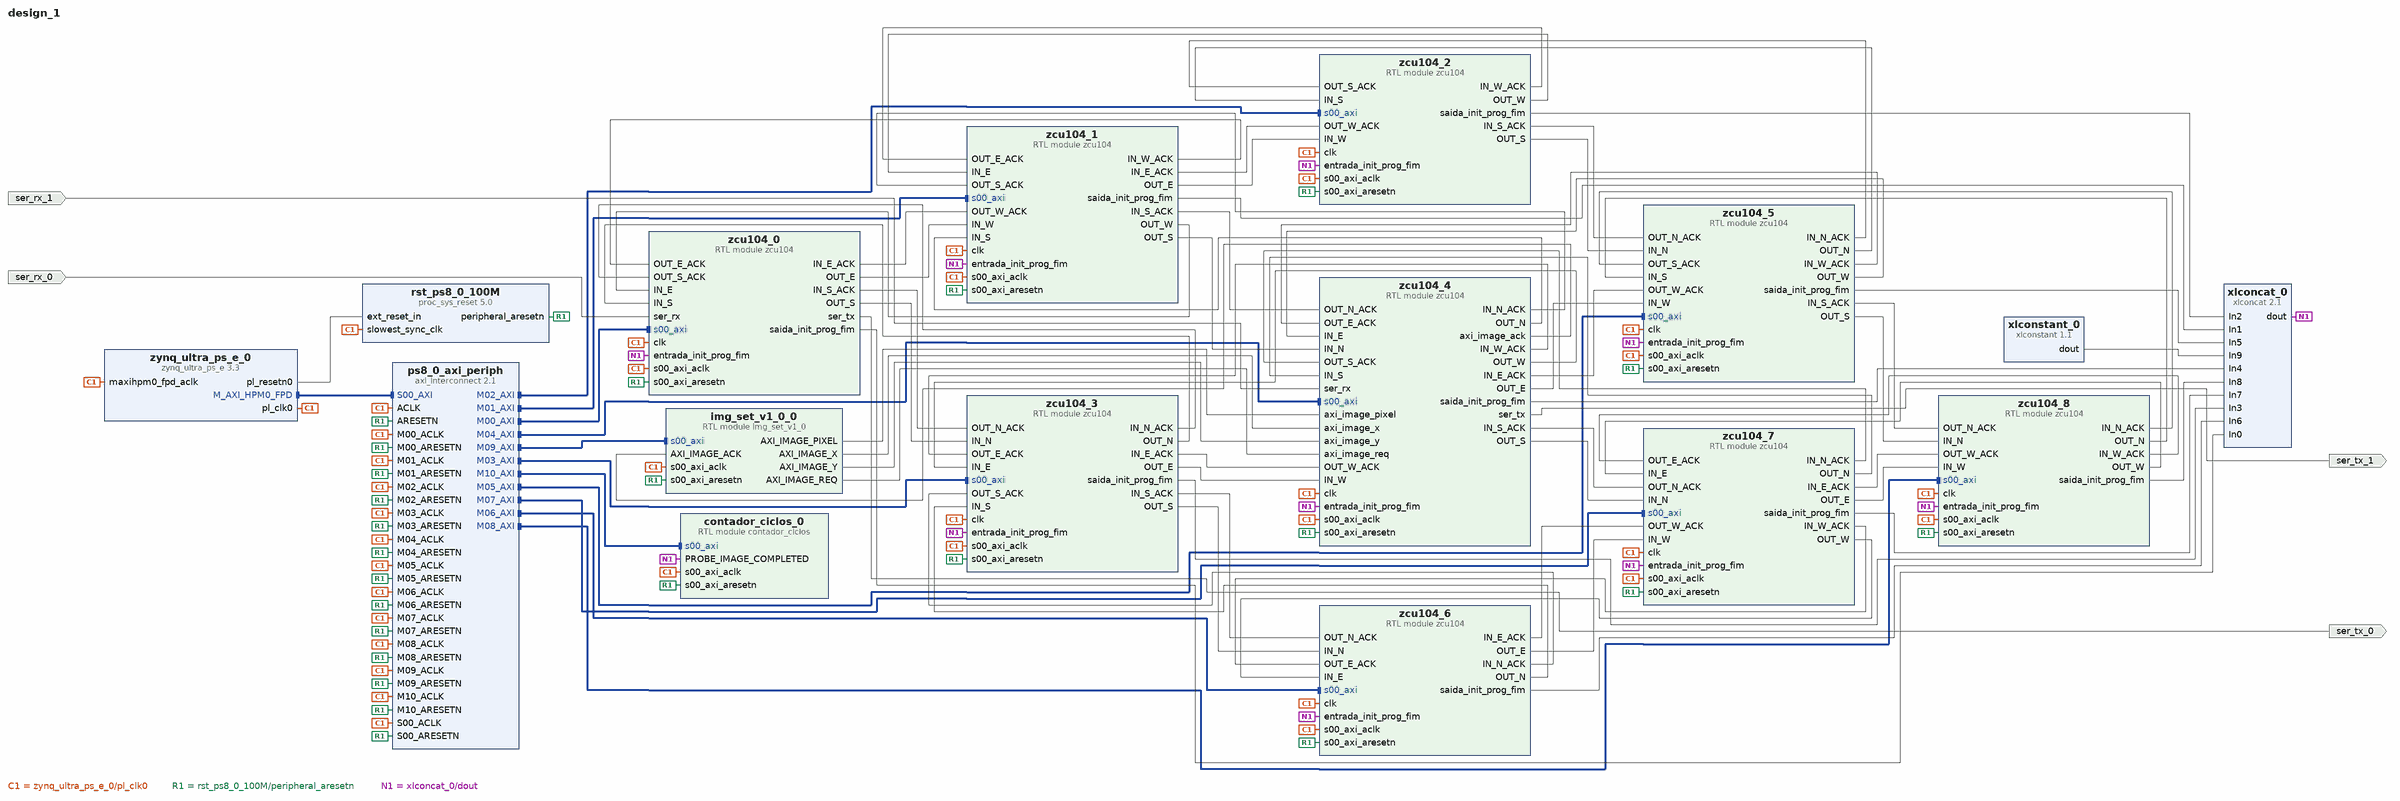
[diagram p0: block diagram of the top level]
# Vivado block design design_1, xczu7ev-ffvc1156-2-e, Vivado 2019.1
create_bd_design design_1

create_bd_port -dir I ser_rx_0
create_bd_port -dir O ser_tx_0
create_bd_port -dir I ser_rx_1
create_bd_port -dir O ser_tx_1

create_bd_cell -type ip -vlnv xilinx.com:ip:zynq_ultra_ps_e:3.3 zynq_ultra_ps_e_0
set_property -dict [list \
  CONFIG.PSU_BANK_0_IO_STANDARD LVCMOS18 \
  CONFIG.PSU_BANK_1_IO_STANDARD LVCMOS18 \
  CONFIG.PSU_BANK_2_IO_STANDARD LVCMOS18 \
  CONFIG.PSU_USB3__DUAL_CLOCK_ENABLE 1 \
  CONFIG.PSU__CAN1__PERIPHERAL__ENABLE 1 \
  CONFIG.PSU__CAN1__PERIPHERAL__IO {MIO 24 .. 25} \
  CONFIG.PSU__CRF_APB__ACPU_CTRL__FREQMHZ 1200 \
  CONFIG.PSU__CRF_APB__ACPU_CTRL__SRCSEL APLL \
  CONFIG.PSU__CRF_APB__APLL_CTRL__SRCSEL PSS_REF_CLK \
  CONFIG.PSU__CRF_APB__DBG_FPD_CTRL__FREQMHZ 250 \
  CONFIG.PSU__CRF_APB__DBG_FPD_CTRL__SRCSEL IOPLL \
  CONFIG.PSU__CRF_APB__DBG_TRACE_CTRL__FREQMHZ 250 \
  CONFIG.PSU__CRF_APB__DBG_TRACE_CTRL__SRCSEL IOPLL \
  CONFIG.PSU__CRF_APB__DBG_TSTMP_CTRL__FREQMHZ 250 \
  CONFIG.PSU__CRF_APB__DBG_TSTMP_CTRL__SRCSEL IOPLL \
  CONFIG.PSU__CRF_APB__DDR_CTRL__FREQMHZ 1067 \
  CONFIG.PSU__CRF_APB__DDR_CTRL__SRCSEL DPLL \
  CONFIG.PSU__CRF_APB__DPDMA_REF_CTRL__FREQMHZ 600 \
  CONFIG.PSU__CRF_APB__DPDMA_REF_CTRL__SRCSEL APLL \
  CONFIG.PSU__CRF_APB__DPLL_CTRL__SRCSEL PSS_REF_CLK \
  CONFIG.PSU__CRF_APB__DP_AUDIO_REF_CTRL__SRCSEL RPLL \
  CONFIG.PSU__CRF_APB__DP_STC_REF_CTRL__SRCSEL RPLL \
  CONFIG.PSU__CRF_APB__DP_VIDEO_REF_CTRL__SRCSEL VPLL \
  CONFIG.PSU__CRF_APB__GDMA_REF_CTRL__FREQMHZ 600 \
  CONFIG.PSU__CRF_APB__GDMA_REF_CTRL__SRCSEL APLL \
  CONFIG.PSU__CRF_APB__GPU_REF_CTRL__FREQMHZ 500 \
  CONFIG.PSU__CRF_APB__GPU_REF_CTRL__SRCSEL IOPLL \
  CONFIG.PSU__CRF_APB__TOPSW_LSBUS_CTRL__FREQMHZ 100 \
  CONFIG.PSU__CRF_APB__TOPSW_LSBUS_CTRL__SRCSEL IOPLL \
  CONFIG.PSU__CRF_APB__TOPSW_MAIN_CTRL__FREQMHZ 533.33 \
  CONFIG.PSU__CRF_APB__TOPSW_MAIN_CTRL__SRCSEL DPLL \
  CONFIG.PSU__CRF_APB__VPLL_CTRL__SRCSEL PSS_REF_CLK \
  CONFIG.PSU__CRL_APB__ADMA_REF_CTRL__FREQMHZ 500 \
  CONFIG.PSU__CRL_APB__ADMA_REF_CTRL__SRCSEL IOPLL \
  CONFIG.PSU__CRL_APB__CAN1_REF_CTRL__FREQMHZ 100 \
  CONFIG.PSU__CRL_APB__CAN1_REF_CTRL__SRCSEL IOPLL \
  CONFIG.PSU__CRL_APB__CPU_R5_CTRL__FREQMHZ 500 \
  CONFIG.PSU__CRL_APB__CPU_R5_CTRL__SRCSEL IOPLL \
  CONFIG.PSU__CRL_APB__DBG_LPD_CTRL__FREQMHZ 250 \
  CONFIG.PSU__CRL_APB__DBG_LPD_CTRL__SRCSEL IOPLL \
  CONFIG.PSU__CRL_APB__GEM3_REF_CTRL__FREQMHZ 125 \
  CONFIG.PSU__CRL_APB__GEM3_REF_CTRL__SRCSEL IOPLL \
  CONFIG.PSU__CRL_APB__I2C0_REF_CTRL__FREQMHZ 100 \
  CONFIG.PSU__CRL_APB__I2C0_REF_CTRL__SRCSEL IOPLL \
  CONFIG.PSU__CRL_APB__I2C1_REF_CTRL__FREQMHZ 100 \
  CONFIG.PSU__CRL_APB__I2C1_REF_CTRL__SRCSEL IOPLL \
  CONFIG.PSU__CRL_APB__IOPLL_CTRL__SRCSEL PSS_REF_CLK \
  CONFIG.PSU__CRL_APB__IOU_SWITCH_CTRL__FREQMHZ 250 \
  CONFIG.PSU__CRL_APB__IOU_SWITCH_CTRL__SRCSEL IOPLL \
  CONFIG.PSU__CRL_APB__LPD_LSBUS_CTRL__FREQMHZ 100 \
  CONFIG.PSU__CRL_APB__LPD_LSBUS_CTRL__SRCSEL IOPLL \
  CONFIG.PSU__CRL_APB__LPD_SWITCH_CTRL__FREQMHZ 500 \
  CONFIG.PSU__CRL_APB__LPD_SWITCH_CTRL__SRCSEL IOPLL \
  CONFIG.PSU__CRL_APB__PCAP_CTRL__FREQMHZ 200 \
  CONFIG.PSU__CRL_APB__PCAP_CTRL__SRCSEL IOPLL \
  CONFIG.PSU__CRL_APB__PL0_REF_CTRL__FREQMHZ 100 \
  CONFIG.PSU__CRL_APB__PL0_REF_CTRL__SRCSEL IOPLL \
  CONFIG.PSU__CRL_APB__QSPI_REF_CTRL__FREQMHZ 125 \
  CONFIG.PSU__CRL_APB__QSPI_REF_CTRL__SRCSEL IOPLL \
  CONFIG.PSU__CRL_APB__RPLL_CTRL__SRCSEL PSS_REF_CLK \
  CONFIG.PSU__CRL_APB__SDIO1_REF_CTRL__FREQMHZ 200 \
  CONFIG.PSU__CRL_APB__SDIO1_REF_CTRL__SRCSEL IOPLL \
  CONFIG.PSU__CRL_APB__TIMESTAMP_REF_CTRL__FREQMHZ 100 \
  CONFIG.PSU__CRL_APB__TIMESTAMP_REF_CTRL__SRCSEL IOPLL \
  CONFIG.PSU__CRL_APB__UART0_REF_CTRL__FREQMHZ 100 \
  CONFIG.PSU__CRL_APB__UART0_REF_CTRL__SRCSEL IOPLL \
  CONFIG.PSU__CRL_APB__UART1_REF_CTRL__FREQMHZ 100 \
  CONFIG.PSU__CRL_APB__UART1_REF_CTRL__SRCSEL IOPLL \
  CONFIG.PSU__CRL_APB__USB0_BUS_REF_CTRL__FREQMHZ 250 \
  CONFIG.PSU__CRL_APB__USB0_BUS_REF_CTRL__SRCSEL IOPLL \
  CONFIG.PSU__CRL_APB__USB3_DUAL_REF_CTRL__FREQMHZ 20 \
  CONFIG.PSU__CRL_APB__USB3_DUAL_REF_CTRL__SRCSEL IOPLL \
  CONFIG.PSU__CRL_APB__USB3__ENABLE 1 \
  CONFIG.PSU__DDRC__BUS_WIDTH {64 Bit} \
  CONFIG.PSU__DDRC__COMPONENTS Components \
  CONFIG.PSU__DDRC__DEVICE_CAPACITY {4096 MBits} \
  CONFIG.PSU__DDRC__DRAM_WIDTH {16 Bits} \
  CONFIG.PSU__DDRC__ECC Disabled \
  CONFIG.PSU__DDRC__MEMORY_TYPE {DDR 4} \
  CONFIG.PSU__DDRC__SPEED_BIN DDR4_2133P \
  CONFIG.PSU__DDR_HIGH_ADDRESS_GUI_ENABLE 0 \
  CONFIG.PSU__DDR__INTERFACE__FREQMHZ 533.500 \
  CONFIG.PSU__DISPLAYPORT__LANE0__ENABLE 1 \
  CONFIG.PSU__DISPLAYPORT__LANE0__IO {GT Lane1} \
  CONFIG.PSU__DISPLAYPORT__LANE1__ENABLE 1 \
  CONFIG.PSU__DISPLAYPORT__LANE1__IO {GT Lane0} \
  CONFIG.PSU__DISPLAYPORT__PERIPHERAL__ENABLE 1 \
  CONFIG.PSU__DLL__ISUSED 1 \
  CONFIG.PSU__DPAUX__PERIPHERAL__ENABLE 1 \
  CONFIG.PSU__DPAUX__PERIPHERAL__IO {MIO 27 .. 30} \
  CONFIG.PSU__DP__LANE_SEL {Dual Lower} \
  CONFIG.PSU__DP__REF_CLK_FREQ 27 \
  CONFIG.PSU__DP__REF_CLK_SEL {Ref Clk3} \
  CONFIG.PSU__ENET3__FIFO__ENABLE 0 \
  CONFIG.PSU__ENET3__GRP_MDIO__ENABLE 1 \
  CONFIG.PSU__ENET3__GRP_MDIO__IO {MIO 76 .. 77} \
  CONFIG.PSU__ENET3__PERIPHERAL__ENABLE 1 \
  CONFIG.PSU__ENET3__PERIPHERAL__IO {MIO 64 .. 75} \
  CONFIG.PSU__ENET3__PTP__ENABLE 0 \
  CONFIG.PSU__ENET3__TSU__ENABLE 0 \
  CONFIG.PSU__FPGA_PL0_ENABLE 1 \
  CONFIG.PSU__GEM3_COHERENCY 0 \
  CONFIG.PSU__GEM3_ROUTE_THROUGH_FPD 0 \
  CONFIG.PSU__GEM__TSU__ENABLE 0 \
  CONFIG.PSU__GPIO0_MIO__PERIPHERAL__ENABLE 0 \
  CONFIG.PSU__GPIO1_MIO__PERIPHERAL__ENABLE 0 \
  CONFIG.PSU__GT__LINK_SPEED HBR \
  CONFIG.PSU__GT__PRE_EMPH_LVL_4 0 \
  CONFIG.PSU__GT__VLT_SWNG_LVL_4 0 \
  CONFIG.PSU__I2C0__PERIPHERAL__ENABLE 0 \
  CONFIG.PSU__I2C1__PERIPHERAL__ENABLE 1 \
  CONFIG.PSU__I2C1__PERIPHERAL__IO {MIO 16 .. 17} \
  CONFIG.PSU__IOU_SLCR__IOU_TTC_APB_CLK__TTC0_SEL APB \
  CONFIG.PSU__IOU_SLCR__IOU_TTC_APB_CLK__TTC1_SEL APB \
  CONFIG.PSU__IOU_SLCR__IOU_TTC_APB_CLK__TTC2_SEL APB \
  CONFIG.PSU__IOU_SLCR__IOU_TTC_APB_CLK__TTC3_SEL APB \
  CONFIG.PSU__MAXIGP0__DATA_WIDTH 32 \
  CONFIG.PSU__OVERRIDE__BASIC_CLOCK 0 \
  CONFIG.PSU__PRESET_APPLIED 1 \
  CONFIG.PSU__PSS_REF_CLK__FREQMHZ 33.333333 \
  CONFIG.PSU__QSPI_COHERENCY 0 \
  CONFIG.PSU__QSPI_ROUTE_THROUGH_FPD 0 \
  CONFIG.PSU__QSPI__GRP_FBCLK__ENABLE 1 \
  CONFIG.PSU__QSPI__GRP_FBCLK__IO {MIO 6} \
  CONFIG.PSU__QSPI__PERIPHERAL__DATA_MODE x4 \
  CONFIG.PSU__QSPI__PERIPHERAL__ENABLE 1 \
  CONFIG.PSU__QSPI__PERIPHERAL__IO {MIO 0 .. 5} \
  CONFIG.PSU__QSPI__PERIPHERAL__MODE Single \
  CONFIG.PSU__SATA__LANE1__IO {GT Lane3} \
  CONFIG.PSU__SATA__PERIPHERAL__ENABLE 1 \
  CONFIG.PSU__SATA__REF_CLK_FREQ 125 \
  CONFIG.PSU__SATA__REF_CLK_SEL {Ref Clk1} \
  CONFIG.PSU__SD1_COHERENCY 0 \
  CONFIG.PSU__SD1_ROUTE_THROUGH_FPD 0 \
  CONFIG.PSU__SD1__DATA_TRANSFER_MODE 4Bit \
  CONFIG.PSU__SD1__GRP_CD__ENABLE 1 \
  CONFIG.PSU__SD1__GRP_CD__IO {MIO 45} \
  CONFIG.PSU__SD1__GRP_POW__ENABLE 0 \
  CONFIG.PSU__SD1__GRP_WP__ENABLE 0 \
  CONFIG.PSU__SD1__PERIPHERAL__ENABLE 1 \
  CONFIG.PSU__SD1__PERIPHERAL__IO {MIO 46 .. 51} \
  CONFIG.PSU__SD1__SLOT_TYPE {SD 2.0} \
  CONFIG.PSU__SWDT0__CLOCK__ENABLE 0 \
  CONFIG.PSU__SWDT0__PERIPHERAL__ENABLE 1 \
  CONFIG.PSU__SWDT0__RESET__ENABLE 0 \
  CONFIG.PSU__SWDT1__CLOCK__ENABLE 0 \
  CONFIG.PSU__SWDT1__PERIPHERAL__ENABLE 1 \
  CONFIG.PSU__SWDT1__RESET__ENABLE 0 \
  CONFIG.PSU__TSU__BUFG_PORT_PAIR 0 \
  CONFIG.PSU__TTC0__CLOCK__ENABLE 0 \
  CONFIG.PSU__TTC0__PERIPHERAL__ENABLE 1 \
  CONFIG.PSU__TTC0__WAVEOUT__ENABLE 0 \
  CONFIG.PSU__TTC1__CLOCK__ENABLE 0 \
  CONFIG.PSU__TTC1__PERIPHERAL__ENABLE 1 \
  CONFIG.PSU__TTC1__WAVEOUT__ENABLE 0 \
  CONFIG.PSU__TTC2__CLOCK__ENABLE 0 \
  CONFIG.PSU__TTC2__PERIPHERAL__ENABLE 1 \
  CONFIG.PSU__TTC2__WAVEOUT__ENABLE 0 \
  CONFIG.PSU__TTC3__CLOCK__ENABLE 0 \
  CONFIG.PSU__TTC3__PERIPHERAL__ENABLE 1 \
  CONFIG.PSU__TTC3__WAVEOUT__ENABLE 0 \
  CONFIG.PSU__UART0__BAUD_RATE 115200 \
  CONFIG.PSU__UART0__MODEM__ENABLE 0 \
  CONFIG.PSU__UART0__PERIPHERAL__ENABLE 1 \
  CONFIG.PSU__UART0__PERIPHERAL__IO {MIO 18 .. 19} \
  CONFIG.PSU__UART1__BAUD_RATE 115200 \
  CONFIG.PSU__UART1__MODEM__ENABLE 0 \
  CONFIG.PSU__UART1__PERIPHERAL__ENABLE 1 \
  CONFIG.PSU__UART1__PERIPHERAL__IO {MIO 20 .. 21} \
  CONFIG.PSU__USB0_COHERENCY 0 \
  CONFIG.PSU__USB0__PERIPHERAL__ENABLE 1 \
  CONFIG.PSU__USB0__PERIPHERAL__IO {MIO 52 .. 63} \
  CONFIG.PSU__USB0__REF_CLK_FREQ 26 \
  CONFIG.PSU__USB0__REF_CLK_SEL {Ref Clk2} \
  CONFIG.PSU__USB2_0__EMIO__ENABLE 0 \
  CONFIG.PSU__USB3_0__EMIO__ENABLE 0 \
  CONFIG.PSU__USB3_0__PERIPHERAL__ENABLE 1 \
  CONFIG.PSU__USB3_0__PERIPHERAL__IO {GT Lane2} \
  CONFIG.PSU__USB__RESET__MODE {Boot Pin} \
  CONFIG.PSU__USB__RESET__POLARITY {Active Low} \
  CONFIG.PSU__USE__IRQ0 1 \
  CONFIG.PSU__USE__M_AXI_GP0 1 \
  CONFIG.PSU__USE__M_AXI_GP1 0 \
  CONFIG.PSU__USE__M_AXI_GP2 0 \
  CONFIG.SUBPRESET1 Custom \
] [get_bd_cells zynq_ultra_ps_e_0]
# 86 more settings of zynq_ultra_ps_e_0 are not shown: defaults, MIO pin electricals, DDR timing, and values the tool derives
create_bd_cell -type ip -vlnv xilinx.com:ip:axi_interconnect:2.1 ps8_0_axi_periph
set_property -dict {CONFIG.NUM_MI 11} [get_bd_cells ps8_0_axi_periph]
create_bd_cell -type ip -vlnv xilinx.com:ip:proc_sys_reset:5.0 rst_ps8_0_100M
create_bd_cell -type module -reference img_set_v1_0 img_set_v1_0_0
create_bd_cell -type ip -vlnv xilinx.com:ip:xlconcat:2.1 xlconcat_0
set_property -dict {CONFIG.IN9_WIDTH 23 CONFIG.NUM_PORTS 10} [get_bd_cells xlconcat_0]
create_bd_cell -type module -reference contador_ciclos contador_ciclos_0
create_bd_cell -type ip -vlnv xilinx.com:ip:xlconstant:1.1 xlconstant_0
set_property -dict {CONFIG.CONST_VAL 0 CONFIG.CONST_WIDTH 23} [get_bd_cells xlconstant_0]
create_bd_cell -type module -reference zcu104 zcu104_0
set_property -dict [list \
  CONFIG.a_steps 10 \
  CONFIG.buffer_length 20 \
  CONFIG.subimg_height 80 \
  CONFIG.subimg_width 80 \
  CONFIG.y_init 0 \
] [get_bd_cells zcu104_0]
create_bd_cell -type module -reference zcu104 zcu104_1
set_property -dict [list \
  CONFIG.a_steps 10 \
  CONFIG.buffer_length 20 \
  CONFIG.subimg_height 80 \
  CONFIG.subimg_width 80 \
  CONFIG.x_init 80 \
  CONFIG.x_local 1 \
  CONFIG.y_init 0 \
] [get_bd_cells zcu104_1]
create_bd_cell -type module -reference zcu104 zcu104_3
set_property -dict [list \
  CONFIG.a_steps 10 \
  CONFIG.buffer_length 20 \
  CONFIG.subimg_height 80 \
  CONFIG.subimg_width 80 \
  CONFIG.x_init 0 \
  CONFIG.y_init 80 \
  CONFIG.y_local 1 \
] [get_bd_cells zcu104_3]
create_bd_cell -type module -reference zcu104 zcu104_2
set_property -dict [list \
  CONFIG.a_steps 10 \
  CONFIG.buffer_length 20 \
  CONFIG.subimg_height 80 \
  CONFIG.subimg_width 80 \
  CONFIG.x_init 160 \
  CONFIG.x_local 2 \
  CONFIG.y_init 0 \
] [get_bd_cells zcu104_2]
create_bd_cell -type module -reference zcu104 zcu104_4
set_property -dict [list \
  CONFIG.a_steps 10 \
  CONFIG.buffer_length 20 \
  CONFIG.subimg_height 80 \
  CONFIG.subimg_width 80 \
  CONFIG.x_init 80 \
  CONFIG.x_local 1 \
  CONFIG.y_init 80 \
  CONFIG.y_local 1 \
] [get_bd_cells zcu104_4]
create_bd_cell -type module -reference zcu104 zcu104_5
set_property -dict [list \
  CONFIG.a_steps 10 \
  CONFIG.buffer_length 20 \
  CONFIG.subimg_height 80 \
  CONFIG.subimg_width 80 \
  CONFIG.x_init 160 \
  CONFIG.x_local 2 \
  CONFIG.y_init 80 \
  CONFIG.y_local 1 \
] [get_bd_cells zcu104_5]
create_bd_cell -type module -reference zcu104 zcu104_6
set_property -dict [list \
  CONFIG.a_steps 10 \
  CONFIG.buffer_length 20 \
  CONFIG.subimg_height 80 \
  CONFIG.subimg_width 80 \
  CONFIG.x_init 0 \
  CONFIG.x_local 0 \
  CONFIG.y_init 160 \
  CONFIG.y_local 2 \
] [get_bd_cells zcu104_6]
create_bd_cell -type module -reference zcu104 zcu104_7
set_property -dict [list \
  CONFIG.a_steps 10 \
  CONFIG.buffer_length 20 \
  CONFIG.subimg_height 80 \
  CONFIG.subimg_width 80 \
  CONFIG.x_init 80 \
  CONFIG.x_local 1 \
  CONFIG.y_init 160 \
  CONFIG.y_local 2 \
] [get_bd_cells zcu104_7]
create_bd_cell -type module -reference zcu104 zcu104_8
set_property -dict [list \
  CONFIG.a_steps 10 \
  CONFIG.buffer_length 20 \
  CONFIG.subimg_height 80 \
  CONFIG.subimg_width 80 \
  CONFIG.x_init 160 \
  CONFIG.x_local 2 \
  CONFIG.y_init 160 \
  CONFIG.y_local 2 \
] [get_bd_cells zcu104_8]

# ---- connections ----

connect_bd_intf_net [get_bd_intf_pins ps8_0_axi_periph/M02_AXI] [get_bd_intf_pins zcu104_2/s00_axi]
connect_bd_intf_net [get_bd_intf_pins zynq_ultra_ps_e_0/M_AXI_HPM0_FPD] [get_bd_intf_pins ps8_0_axi_periph/S00_AXI]
connect_bd_intf_net [get_bd_intf_pins ps8_0_axi_periph/M06_AXI] [get_bd_intf_pins zcu104_6/s00_axi]
connect_bd_intf_net [get_bd_intf_pins ps8_0_axi_periph/M05_AXI] [get_bd_intf_pins zcu104_5/s00_axi]
connect_bd_intf_net [get_bd_intf_pins ps8_0_axi_periph/M03_AXI] [get_bd_intf_pins zcu104_3/s00_axi]
connect_bd_intf_net [get_bd_intf_pins ps8_0_axi_periph/M08_AXI] [get_bd_intf_pins zcu104_8/s00_axi]
connect_bd_intf_net [get_bd_intf_pins ps8_0_axi_periph/M09_AXI] [get_bd_intf_pins img_set_v1_0_0/s00_axi]
connect_bd_intf_net [get_bd_intf_pins ps8_0_axi_periph/M00_AXI] [get_bd_intf_pins zcu104_0/s00_axi]
connect_bd_intf_net [get_bd_intf_pins ps8_0_axi_periph/M04_AXI] [get_bd_intf_pins zcu104_4/s00_axi]
connect_bd_intf_net [get_bd_intf_pins ps8_0_axi_periph/M01_AXI] [get_bd_intf_pins zcu104_1/s00_axi]
connect_bd_intf_net [get_bd_intf_pins ps8_0_axi_periph/M10_AXI] [get_bd_intf_pins contador_ciclos_0/s00_axi]
connect_bd_intf_net [get_bd_intf_pins ps8_0_axi_periph/M07_AXI] [get_bd_intf_pins zcu104_7/s00_axi]
connect_bd_net [get_bd_pins zynq_ultra_ps_e_0/pl_clk0] \
  [get_bd_pins zynq_ultra_ps_e_0/maxihpm0_fpd_aclk] [get_bd_pins ps8_0_axi_periph/S00_ACLK] \
  [get_bd_pins rst_ps8_0_100M/slowest_sync_clk] [get_bd_pins ps8_0_axi_periph/M00_ACLK] [get_bd_pins ps8_0_axi_periph/ACLK] \
  [get_bd_pins ps8_0_axi_periph/M01_ACLK] [get_bd_pins ps8_0_axi_periph/M02_ACLK] [get_bd_pins ps8_0_axi_periph/M03_ACLK] \
  [get_bd_pins ps8_0_axi_periph/M04_ACLK] [get_bd_pins ps8_0_axi_periph/M05_ACLK] [get_bd_pins ps8_0_axi_periph/M06_ACLK] \
  [get_bd_pins ps8_0_axi_periph/M07_ACLK] [get_bd_pins ps8_0_axi_periph/M08_ACLK] [get_bd_pins img_set_v1_0_0/s00_axi_aclk] \
  [get_bd_pins ps8_0_axi_periph/M09_ACLK] [get_bd_pins ps8_0_axi_periph/M10_ACLK] \
  [get_bd_pins contador_ciclos_0/s00_axi_aclk] [get_bd_pins zcu104_0/clk] [get_bd_pins zcu104_0/s00_axi_aclk] \
  [get_bd_pins zcu104_1/clk] [get_bd_pins zcu104_1/s00_axi_aclk] [get_bd_pins zcu104_3/clk] \
  [get_bd_pins zcu104_3/s00_axi_aclk] [get_bd_pins zcu104_2/clk] [get_bd_pins zcu104_2/s00_axi_aclk] \
  [get_bd_pins zcu104_4/clk] [get_bd_pins zcu104_4/s00_axi_aclk] [get_bd_pins zcu104_5/clk] \
  [get_bd_pins zcu104_5/s00_axi_aclk] [get_bd_pins zcu104_6/clk] [get_bd_pins zcu104_6/s00_axi_aclk] \
  [get_bd_pins zcu104_7/clk] [get_bd_pins zcu104_7/s00_axi_aclk] [get_bd_pins zcu104_8/clk] \
  [get_bd_pins zcu104_8/s00_axi_aclk]
connect_bd_net [get_bd_pins zynq_ultra_ps_e_0/pl_resetn0] [get_bd_pins rst_ps8_0_100M/ext_reset_in]
connect_bd_net [get_bd_pins rst_ps8_0_100M/peripheral_aresetn] \
  [get_bd_pins ps8_0_axi_periph/S00_ARESETN] [get_bd_pins ps8_0_axi_periph/M00_ARESETN] \
  [get_bd_pins ps8_0_axi_periph/ARESETN] [get_bd_pins ps8_0_axi_periph/M01_ARESETN] \
  [get_bd_pins ps8_0_axi_periph/M02_ARESETN] [get_bd_pins ps8_0_axi_periph/M03_ARESETN] \
  [get_bd_pins ps8_0_axi_periph/M04_ARESETN] [get_bd_pins ps8_0_axi_periph/M05_ARESETN] \
  [get_bd_pins ps8_0_axi_periph/M06_ARESETN] [get_bd_pins ps8_0_axi_periph/M07_ARESETN] \
  [get_bd_pins ps8_0_axi_periph/M08_ARESETN] [get_bd_pins img_set_v1_0_0/s00_axi_aresetn] \
  [get_bd_pins ps8_0_axi_periph/M09_ARESETN] [get_bd_pins ps8_0_axi_periph/M10_ARESETN] \
  [get_bd_pins contador_ciclos_0/s00_axi_aresetn] [get_bd_pins zcu104_0/s00_axi_aresetn] \
  [get_bd_pins zcu104_1/s00_axi_aresetn] [get_bd_pins zcu104_3/s00_axi_aresetn] [get_bd_pins zcu104_2/s00_axi_aresetn] \
  [get_bd_pins zcu104_4/s00_axi_aresetn] [get_bd_pins zcu104_5/s00_axi_aresetn] [get_bd_pins zcu104_6/s00_axi_aresetn] \
  [get_bd_pins zcu104_7/s00_axi_aresetn] [get_bd_pins zcu104_8/s00_axi_aresetn]
connect_bd_net -net ser_rx_0_1 [get_bd_ports ser_rx_0] [get_bd_pins zcu104_0/ser_rx]
connect_bd_net [get_bd_pins zcu104_0/ser_tx] [get_bd_ports ser_tx_0]
connect_bd_net [get_bd_pins zcu104_3/IN_N_ACK] [get_bd_pins zcu104_0/OUT_S_ACK]
connect_bd_net [get_bd_pins zcu104_0/IN_S_ACK] [get_bd_pins zcu104_3/OUT_N_ACK]
connect_bd_net [get_bd_pins zcu104_0/OUT_S] [get_bd_pins zcu104_3/IN_N]
connect_bd_net [get_bd_pins zcu104_3/OUT_N] [get_bd_pins zcu104_0/IN_S]
connect_bd_net [get_bd_pins zcu104_6/IN_N_ACK] [get_bd_pins zcu104_3/OUT_S_ACK]
connect_bd_net [get_bd_pins zcu104_3/IN_S_ACK] [get_bd_pins zcu104_6/OUT_N_ACK]
connect_bd_net [get_bd_pins zcu104_3/OUT_S] [get_bd_pins zcu104_6/IN_N]
connect_bd_net [get_bd_pins zcu104_6/OUT_N] [get_bd_pins zcu104_3/IN_S]
connect_bd_net [get_bd_pins zcu104_4/IN_N_ACK] [get_bd_pins zcu104_1/OUT_S_ACK]
connect_bd_net [get_bd_pins zcu104_1/IN_S_ACK] [get_bd_pins zcu104_4/OUT_N_ACK]
connect_bd_net [get_bd_pins zcu104_1/OUT_S] [get_bd_pins zcu104_4/IN_N]
connect_bd_net [get_bd_pins zcu104_4/OUT_N] [get_bd_pins zcu104_1/IN_S]
connect_bd_net [get_bd_pins zcu104_7/IN_N_ACK] [get_bd_pins zcu104_4/OUT_S_ACK]
connect_bd_net [get_bd_pins zcu104_4/IN_S_ACK] [get_bd_pins zcu104_7/OUT_N_ACK]
connect_bd_net [get_bd_pins zcu104_4/OUT_S] [get_bd_pins zcu104_7/IN_N]
connect_bd_net [get_bd_pins zcu104_7/OUT_N] [get_bd_pins zcu104_4/IN_S]
connect_bd_net [get_bd_pins zcu104_5/IN_N_ACK] [get_bd_pins zcu104_2/OUT_S_ACK]
connect_bd_net [get_bd_pins zcu104_2/IN_S_ACK] [get_bd_pins zcu104_5/OUT_N_ACK]
connect_bd_net [get_bd_pins zcu104_2/OUT_S] [get_bd_pins zcu104_5/IN_N]
connect_bd_net [get_bd_pins zcu104_5/OUT_N] [get_bd_pins zcu104_2/IN_S]
connect_bd_net [get_bd_pins zcu104_8/IN_N_ACK] [get_bd_pins zcu104_5/OUT_S_ACK]
connect_bd_net [get_bd_pins zcu104_5/IN_S_ACK] [get_bd_pins zcu104_8/OUT_N_ACK]
connect_bd_net [get_bd_pins zcu104_5/OUT_S] [get_bd_pins zcu104_8/IN_N]
connect_bd_net [get_bd_pins zcu104_8/OUT_N] [get_bd_pins zcu104_5/IN_S]
connect_bd_net [get_bd_pins zcu104_1/IN_W_ACK] [get_bd_pins zcu104_0/OUT_E_ACK]
connect_bd_net [get_bd_pins zcu104_0/IN_E_ACK] [get_bd_pins zcu104_1/OUT_W_ACK]
connect_bd_net [get_bd_pins zcu104_0/OUT_E] [get_bd_pins zcu104_1/IN_W]
connect_bd_net [get_bd_pins zcu104_1/OUT_W] [get_bd_pins zcu104_0/IN_E]
connect_bd_net [get_bd_pins zcu104_2/IN_W_ACK] [get_bd_pins zcu104_1/OUT_E_ACK]
connect_bd_net [get_bd_pins zcu104_1/IN_E_ACK] [get_bd_pins zcu104_2/OUT_W_ACK]
connect_bd_net [get_bd_pins zcu104_1/OUT_E] [get_bd_pins zcu104_2/IN_W]
connect_bd_net [get_bd_pins zcu104_2/OUT_W] [get_bd_pins zcu104_1/IN_E]
connect_bd_net [get_bd_pins zcu104_4/IN_W_ACK] [get_bd_pins zcu104_3/OUT_E_ACK]
connect_bd_net [get_bd_pins zcu104_3/IN_E_ACK] [get_bd_pins zcu104_4/OUT_W_ACK]
connect_bd_net [get_bd_pins zcu104_3/OUT_E] [get_bd_pins zcu104_4/IN_W]
connect_bd_net [get_bd_pins zcu104_4/OUT_W] [get_bd_pins zcu104_3/IN_E]
connect_bd_net [get_bd_pins zcu104_5/IN_W_ACK] [get_bd_pins zcu104_4/OUT_E_ACK]
connect_bd_net [get_bd_pins zcu104_4/IN_E_ACK] [get_bd_pins zcu104_5/OUT_W_ACK]
connect_bd_net [get_bd_pins zcu104_4/OUT_E] [get_bd_pins zcu104_5/IN_W]
connect_bd_net [get_bd_pins zcu104_5/OUT_W] [get_bd_pins zcu104_4/IN_E]
connect_bd_net [get_bd_pins zcu104_7/IN_W_ACK] [get_bd_pins zcu104_6/OUT_E_ACK]
connect_bd_net [get_bd_pins zcu104_6/IN_E_ACK] [get_bd_pins zcu104_7/OUT_W_ACK]
connect_bd_net [get_bd_pins zcu104_6/OUT_E] [get_bd_pins zcu104_7/IN_W]
connect_bd_net [get_bd_pins zcu104_7/OUT_W] [get_bd_pins zcu104_6/IN_E]
connect_bd_net [get_bd_pins zcu104_8/IN_W_ACK] [get_bd_pins zcu104_7/OUT_E_ACK]
connect_bd_net [get_bd_pins zcu104_7/IN_E_ACK] [get_bd_pins zcu104_8/OUT_W_ACK]
connect_bd_net [get_bd_pins zcu104_7/OUT_E] [get_bd_pins zcu104_8/IN_W]
connect_bd_net [get_bd_pins zcu104_8/OUT_W] [get_bd_pins zcu104_7/IN_E]
connect_bd_net -net ser_rx_1_1 [get_bd_ports ser_rx_1] [get_bd_pins zcu104_4/ser_rx]
connect_bd_net [get_bd_pins zcu104_4/ser_tx] [get_bd_ports ser_tx_1]
connect_bd_net [get_bd_pins img_set_v1_0_0/AXI_IMAGE_PIXEL] [get_bd_pins zcu104_4/axi_image_pixel]
connect_bd_net [get_bd_pins img_set_v1_0_0/AXI_IMAGE_X] [get_bd_pins zcu104_4/axi_image_x]
connect_bd_net [get_bd_pins img_set_v1_0_0/AXI_IMAGE_Y] [get_bd_pins zcu104_4/axi_image_y]
connect_bd_net [get_bd_pins img_set_v1_0_0/AXI_IMAGE_REQ] [get_bd_pins zcu104_4/axi_image_req]
connect_bd_net [get_bd_pins zcu104_4/axi_image_ack] [get_bd_pins img_set_v1_0_0/AXI_IMAGE_ACK]
connect_bd_net [get_bd_pins zcu104_0/saida_init_prog_fim] [get_bd_pins xlconcat_0/In0]
connect_bd_net [get_bd_pins zcu104_1/saida_init_prog_fim] [get_bd_pins xlconcat_0/In1]
connect_bd_net [get_bd_pins zcu104_2/saida_init_prog_fim] [get_bd_pins xlconcat_0/In2]
connect_bd_net [get_bd_pins zcu104_3/saida_init_prog_fim] [get_bd_pins xlconcat_0/In3]
connect_bd_net [get_bd_pins zcu104_4/saida_init_prog_fim] [get_bd_pins xlconcat_0/In4]
connect_bd_net [get_bd_pins zcu104_5/saida_init_prog_fim] [get_bd_pins xlconcat_0/In5]
connect_bd_net [get_bd_pins zcu104_6/saida_init_prog_fim] [get_bd_pins xlconcat_0/In6]
connect_bd_net [get_bd_pins zcu104_7/saida_init_prog_fim] [get_bd_pins xlconcat_0/In7]
connect_bd_net [get_bd_pins zcu104_8/saida_init_prog_fim] [get_bd_pins xlconcat_0/In8]
connect_bd_net [get_bd_pins xlconcat_0/dout] \
  [get_bd_pins contador_ciclos_0/PROBE_IMAGE_COMPLETED] [get_bd_pins zcu104_0/entrada_init_prog_fim] \
  [get_bd_pins zcu104_1/entrada_init_prog_fim] [get_bd_pins zcu104_3/entrada_init_prog_fim] \
  [get_bd_pins zcu104_2/entrada_init_prog_fim] [get_bd_pins zcu104_4/entrada_init_prog_fim] \
  [get_bd_pins zcu104_5/entrada_init_prog_fim] [get_bd_pins zcu104_6/entrada_init_prog_fim] \
  [get_bd_pins zcu104_7/entrada_init_prog_fim] [get_bd_pins zcu104_8/entrada_init_prog_fim]
connect_bd_net [get_bd_pins xlconstant_0/dout] [get_bd_pins xlconcat_0/In9]

# ---- address map ----
assign_bd_address -offset 0x00A0000000 -range 4K -target_address_space [get_bd_addr_spaces zynq_ultra_ps_e_0/Data] [get_bd_addr_segs img_set_v1_0_0/s00_axi/reg0]
assign_bd_address -offset 0x00A0001000 -range 4K -target_address_space [get_bd_addr_spaces zynq_ultra_ps_e_0/Data] [get_bd_addr_segs contador_ciclos_0/s00_axi/reg0]
assign_bd_address -offset 0x0400000000 -range 4G -target_address_space [get_bd_addr_spaces zynq_ultra_ps_e_0/Data] [get_bd_addr_segs zcu104_0/s00_axi/reg0]
assign_bd_address -offset 0x1000000000 -range 4G -target_address_space [get_bd_addr_spaces zynq_ultra_ps_e_0/Data] [get_bd_addr_segs zcu104_1/s00_axi/reg0]
assign_bd_address -offset 0x1100000000 -range 4G -target_address_space [get_bd_addr_spaces zynq_ultra_ps_e_0/Data] [get_bd_addr_segs zcu104_2/s00_axi/reg0]
assign_bd_address -offset 0x1200000000 -range 4G -target_address_space [get_bd_addr_spaces zynq_ultra_ps_e_0/Data] [get_bd_addr_segs zcu104_3/s00_axi/reg0]
assign_bd_address -offset 0x1300000000 -range 4G -target_address_space [get_bd_addr_spaces zynq_ultra_ps_e_0/Data] [get_bd_addr_segs zcu104_4/s00_axi/reg0]
assign_bd_address -offset 0x1400000000 -range 4G -target_address_space [get_bd_addr_spaces zynq_ultra_ps_e_0/Data] [get_bd_addr_segs zcu104_5/s00_axi/reg0]
assign_bd_address -offset 0x1500000000 -range 4G -target_address_space [get_bd_addr_spaces zynq_ultra_ps_e_0/Data] [get_bd_addr_segs zcu104_6/s00_axi/reg0]
assign_bd_address -offset 0x1600000000 -range 4G -target_address_space [get_bd_addr_spaces zynq_ultra_ps_e_0/Data] [get_bd_addr_segs zcu104_7/s00_axi/reg0]
assign_bd_address -offset 0x1700000000 -range 4G -target_address_space [get_bd_addr_spaces zynq_ultra_ps_e_0/Data] [get_bd_addr_segs zcu104_8/s00_axi/reg0]

validate_bd_design
save_bd_design
